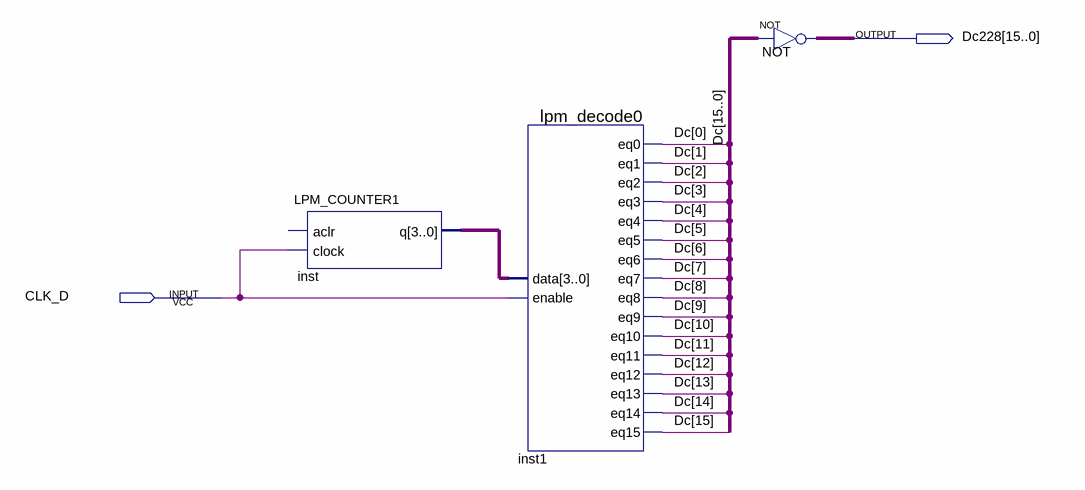
[diagram p0: schematic sheet]
// Quartus schematic Block3.bdf as structural Verilog: 3 symbols, 2 pins
module Block3 (
  input  CLK_D,
  output [15:0] Dc228
);

  wire [3:0] inst_q;
  wire [15:0] Dc;

  LPM_COUNTER1 inst (.clock(CLK_D), .q(inst_q));  // open: aclr
  lpm_decode0 inst1 (
    .data(inst_q), .enable(CLK_D), .eq0(Dc[0]), .eq1(Dc[1]), .eq2(Dc[2]), .eq3(Dc[3]), .eq4(Dc[4]),
    .eq5(Dc[5]), .eq6(Dc[6]), .eq7(Dc[7]), .eq8(Dc[8]), .eq9(Dc[9]), .eq10(Dc[10]), .eq11(Dc[11]),
    .eq12(Dc[12]), .eq13(Dc[13]), .eq14(Dc[14]), .eq15(Dc[15]));
  assign Dc228 = ~Dc;  // NOT NOT, 16 bits wide
endmodule
